# EAGLE design ignition3 (EAGLE 7.2.0)
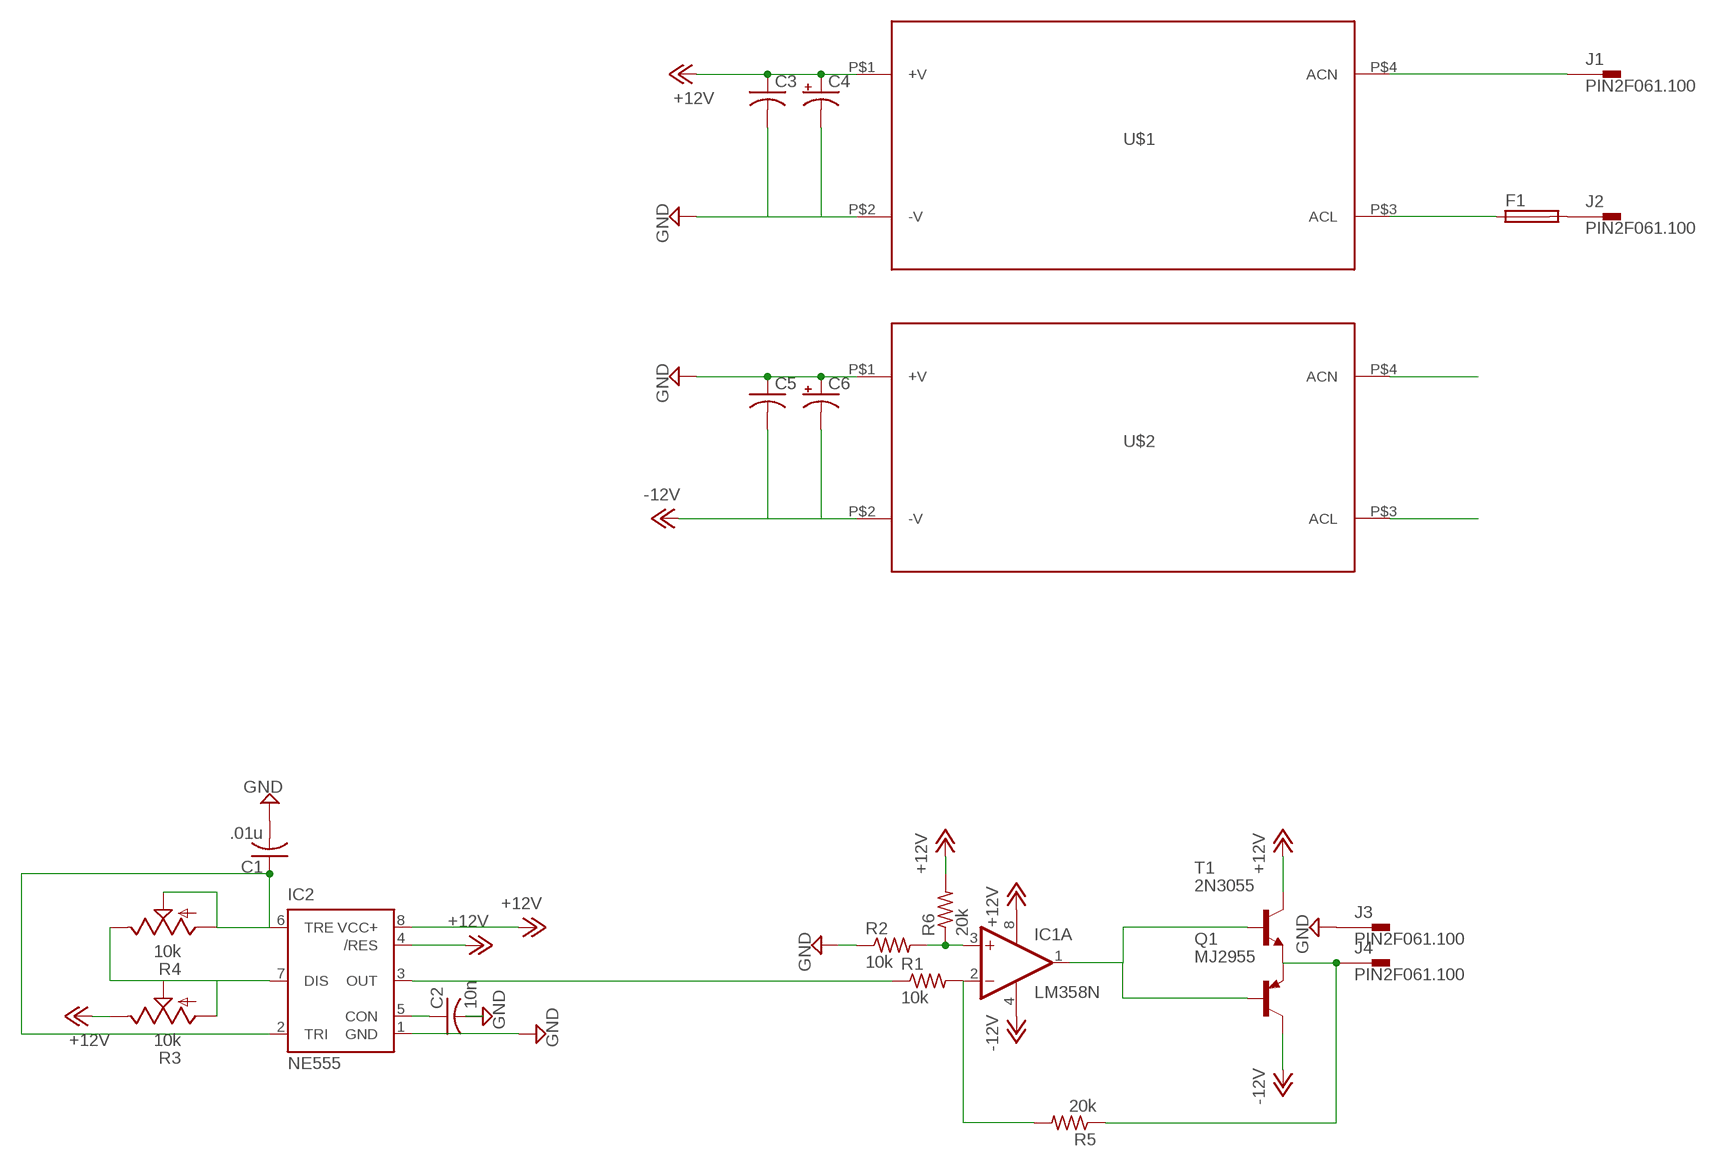
[diagram p0: schematic, sheet 1]

## Parts
C1  .01u  C-US050-035X075  [C050-035X075]
C2  10n  C-US075-042X103  [C075-042X103]
C3  C-US050-035X075  [C050-035X075]
C4  CPOL-USE5-5  [E5-5]
C5  C-US050-035X075  [C050-035X075]
C6  CPOL-USE5-5  [E5-5]
F1  SH25  [SH25]
IC1  LM358N  [DIL08]
IC2  NE555  [DIL-08]
J1  PIN2F061.100  [F061.100]
J2  PIN2F061.100  [F061.100]
J3  PIN2F061.100  [F061.100]
J4  PIN2F061.100  [F061.100]
Q1  MJ2955  [TO3]
R1  10k  R-US_0207/10  [0207/10]
R2  10k  R-US_0207/10  [0207/10]
R3  10k  TRIM_US-B64Y  [B64Y]
R4  10k  TRIM_US-B64Y  [B64Y]
R5  20k  R-US_0207/10  [0207/10]
R6  20k  R-US_0207/10  [0207/10]
T1  2N3055  [TO3]
U$1  IRM-60-12  [IRM-60-12]
U$2  IRM-60-12  [IRM-60-12]

## Nets
+12V: C3.1 C4.+ IC1.8(P:V+) IC2.4(/RES) IC2.8(VCC+) R3.E R6.2 T1.C T1.C/(C) U$1.P$1(+V)
-12V: C5.2 C6.- IC1.4(P:V-) Q1.C Q1.C/(C) U$2.P$2(-V)
GND: C1.2 C2.2 C3.2 C4.- C5.1 C6.+ IC2.1(GND) J3.A1 J3.A2 R2.1 U$1.P$2(-V) U$2.P$1(+V)
L: F1.1 U$1.P$3(ACL) U$2.P$3(ACL)
N: J1.A1 J1.A2 U$1.P$4(ACN) U$2.P$4(ACN)
N$1: IC1.2(A:-IN) R1.2 R5.2
N$2: C2.1 IC2.5(CON)
N$3: J4.A1 J4.A2 Q1.E R5.1 T1.E
N$5: F1.2 J2.A1 J2.A2
N$6: IC1.1(A:OUT) Q1.B T1.B
N$7: C1.1 IC2.2(TRI) IC2.6(TRE) R4.A R4.S
N$8: IC2.7(DIS) R3.A R3.S R4.E
N$9: IC1.3(A:+IN) R2.2 R6.1
N$12: IC2.3(OUT) R1.1
Unconnected: IC1.5(B:+IN) IC1.6(B:-IN) IC1.7(B:OUT)

## Library data of the parts
C1-C3 C5 = rcl:C-US: CAPACITOR, American symbol
C4 C6 = rcl:CPOL-US: POLARIZED CAPACITOR, American symbol
F1 = fuse:SH25: FUSE HOLDER grid 25 mm, OGN0031 8211, Schurter (Buerklin); MF: SCHURTER; MPN: 0031.8211; OC_FARNELL: 1162741; OC_NEWARK: 96B9380
IC1 = linear:LM358: OP AMP also LM158; LM258; LM2904 Source: http://cache.national.com/ds/LM/LM158.pdf
IC2 = st-microelectronics:NE555: General purpose bipolar Timer; MF: Arrow Electronics; MPN: NE555N; OC_FARNELL: 1467742; OC_NEWARK: 89K1486
J1-J4 = con-faston:PIN2: Flachstecker Typ Tyco/Electronics/AMP TAB, FASTON Printed Circuit Board Tabs Source: http://www.buerklin.com, http://catalog.tycoelectronics.com; OC_FARNELL: unknown; OC_NEWARK: unknown
Q1 = transistor-pnp:MJ2955: PNP Transistor
R1 R2 R5 R6 = resistor:R-US_: RESISTOR, American symbol
R3 R4 = pot:TRIM_US-: POTENTIOMETER
T1 = transistor:2N3055: NPN TRANSISTOR
U$1 U$2 = meanwell:IRM-60-12

## Board
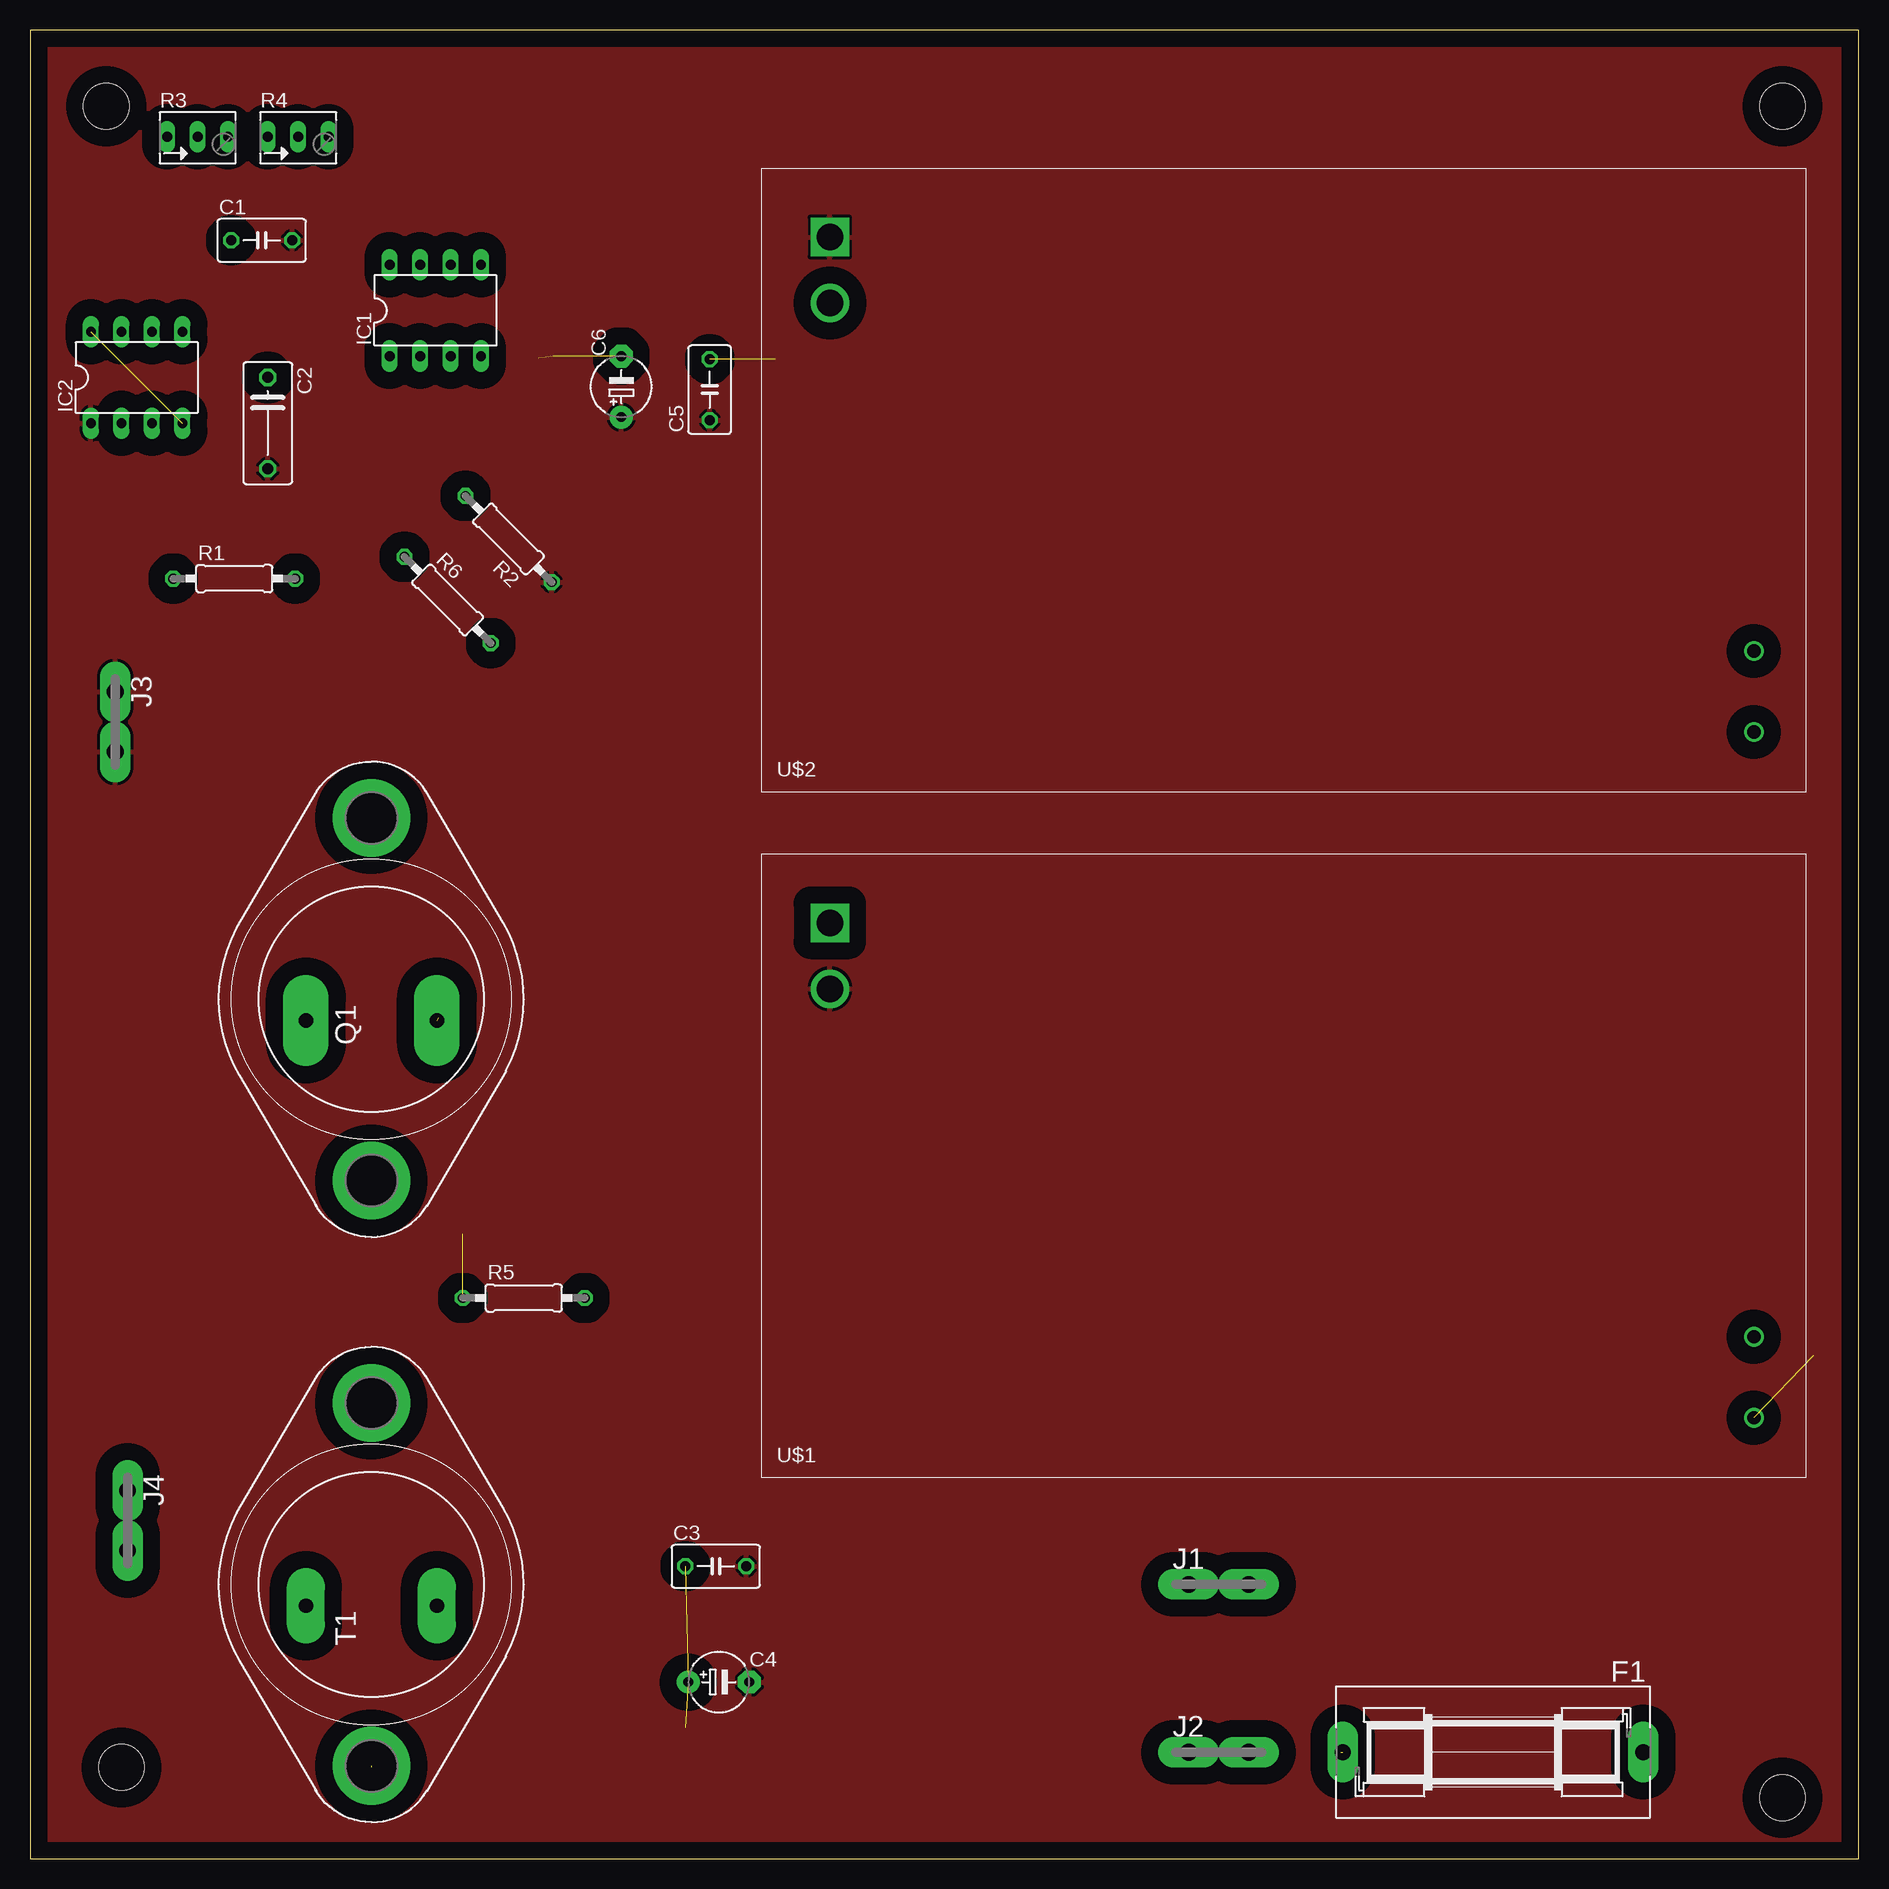
[diagram p1: board, top side]
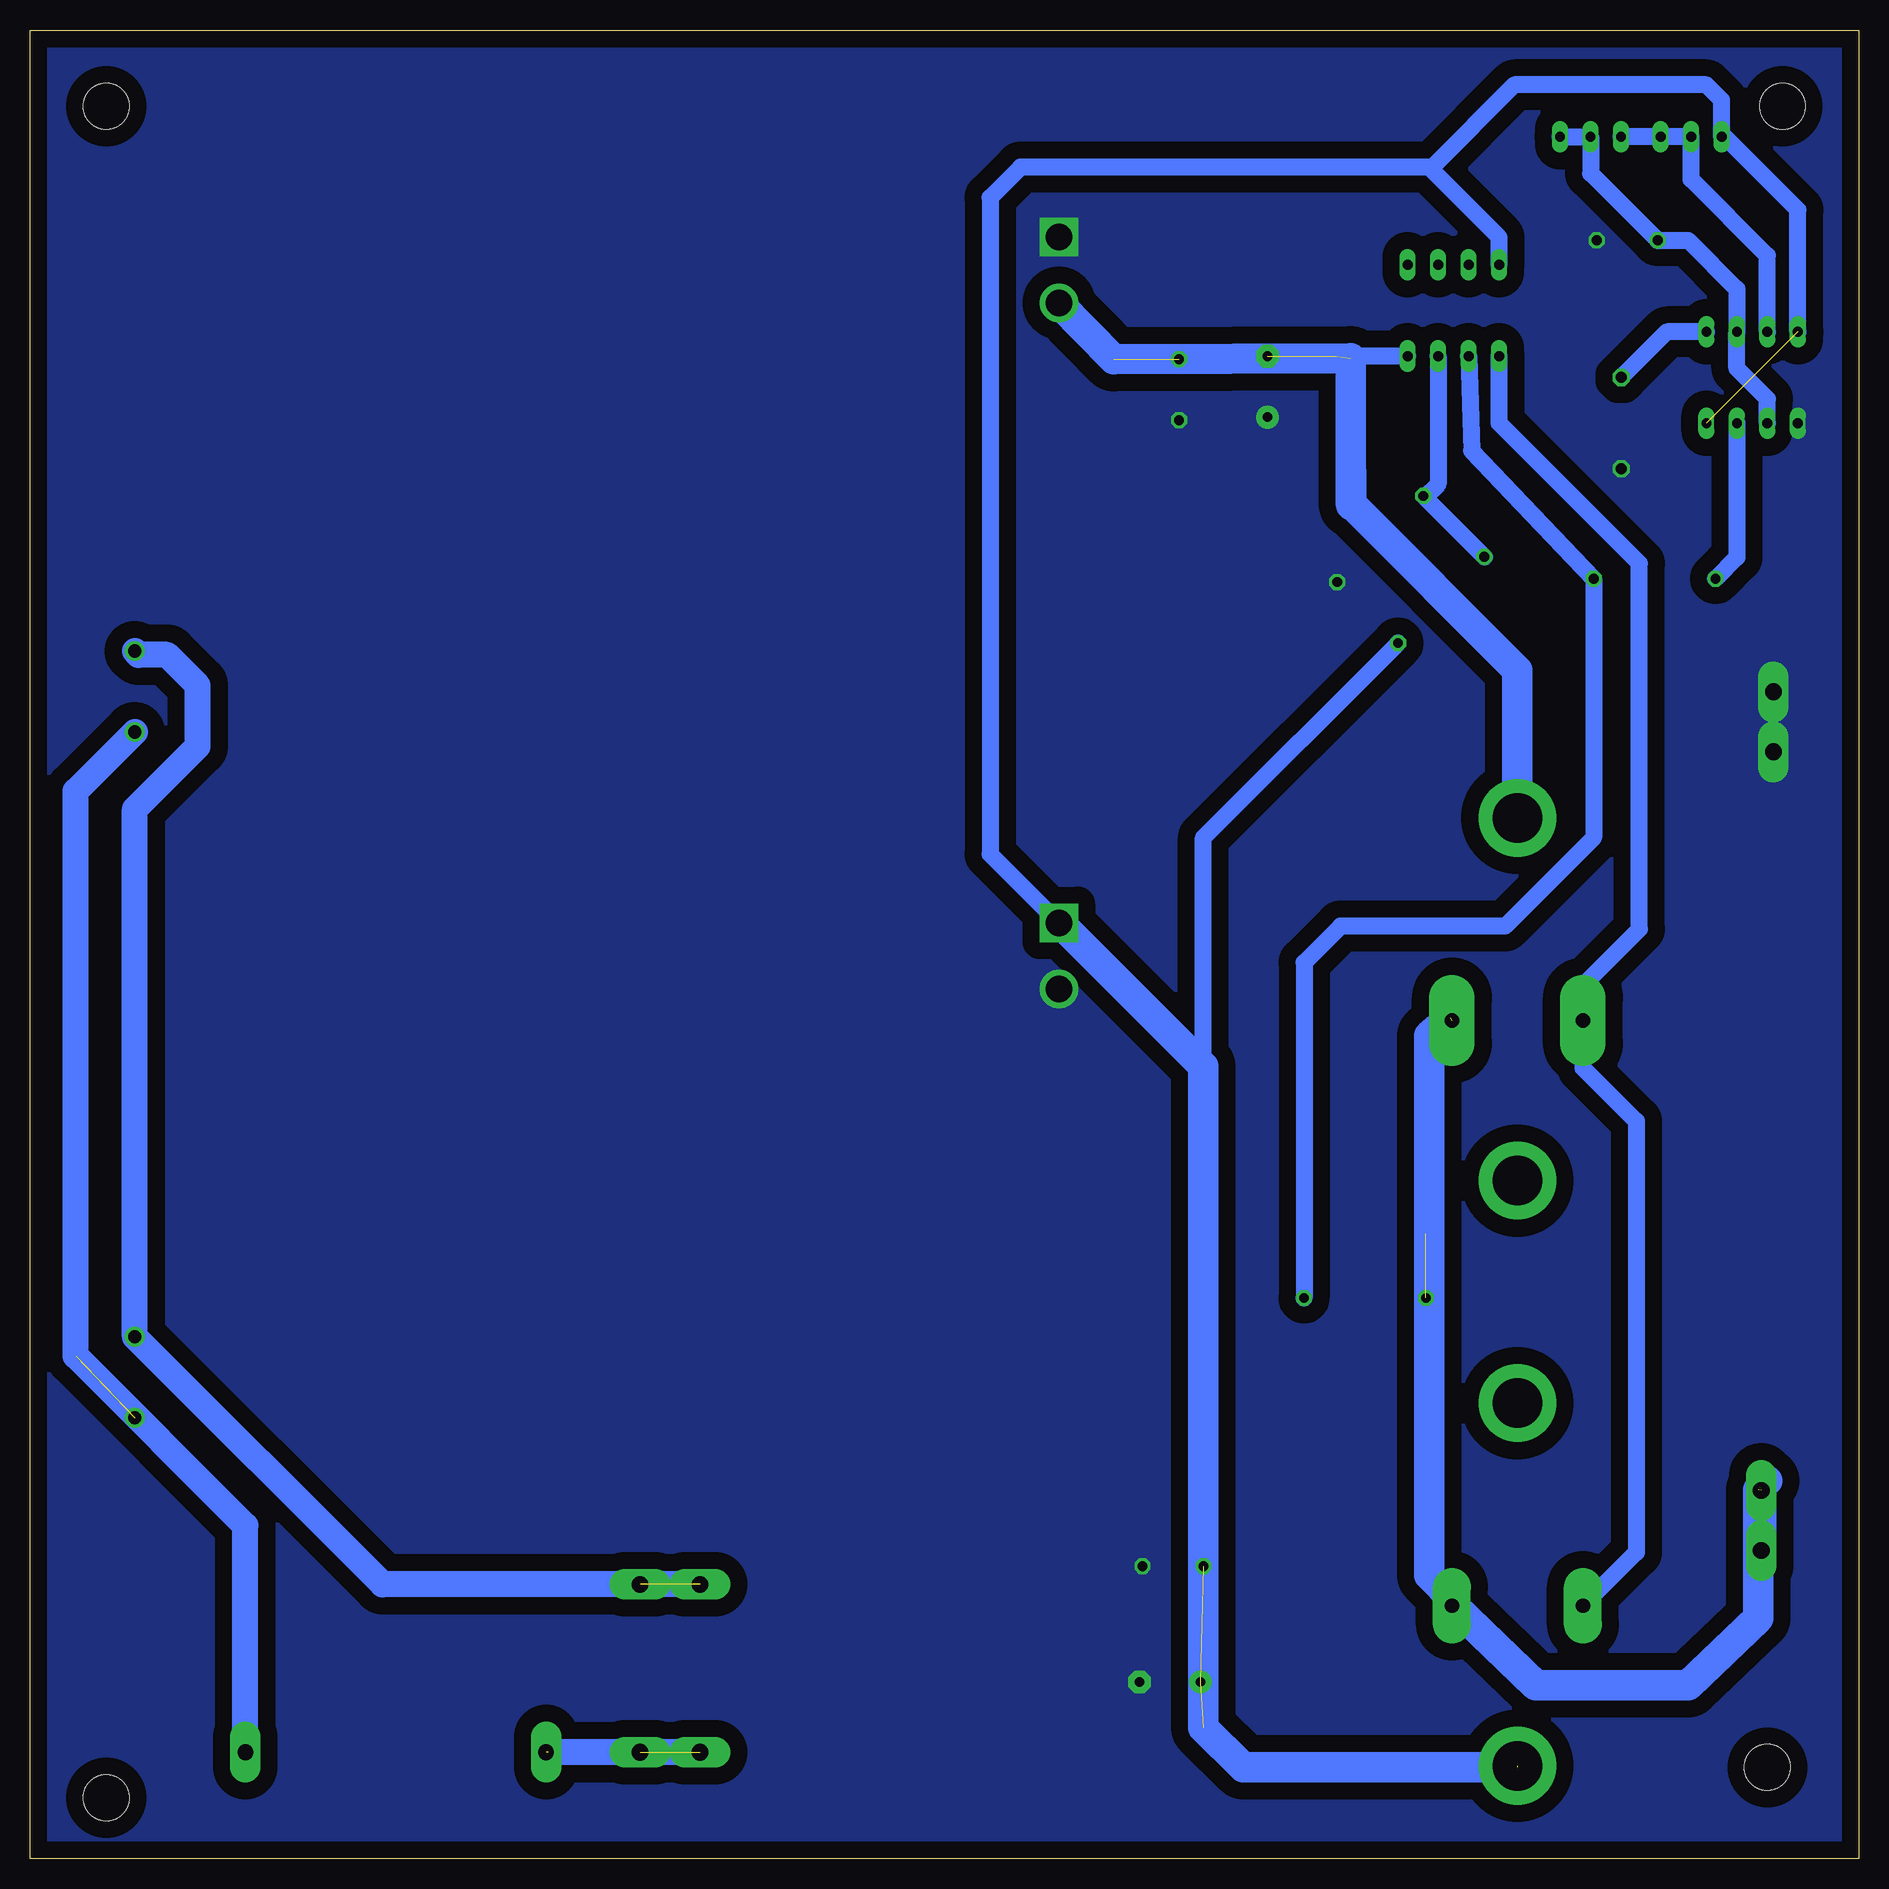
[diagram p2: board, bottom side, seen from below]

Size 152.4 x 152.4 mm. Coordinates in mm from the lower left corner, seen from the top.
Outline: 0,0 152.4,0 152.4,152.4 0,152.4 0,0
Copper layers (1*16): Top 0.035mm / dielectric 1.5mm / Bottom 0.035mm
Design rules "default": minimum track width 10mil, minimum drill 24mil, track to track 8mil, track to pad 8mil, pad to pad 8mil, via to via 8mil, smd to smd 8mil, copper to edge 40mil, drill to drill 8mil, minimum pad ring 10mil, minimum via ring 8mil, stop-mask expansion 4mil, vias tented up to drill 0mil, thermal gap 10mil
Holes 3.8 mm at 146.05,5.08 6.35,146.05 7.62,7.62 146.05,146.05

### Footprints (pad centres in the part's own frame; a part is rotated, then mirrored left to right if it is on the bottom)
C050-035X075 = drill 0.813 octagon: 1 -2.54,0; 2 2.54,0
C075-042X103 = drill 0.914 octagon: 1 -3.81,0; 2 3.81,0
E5-5 = drill 0.813 pad 1.905: + -2.54,0 | drill 0.813 pad 1.905 octagon: - 2.54,0
SH25 = drill 1.321 pad 2.54 long: 1 -12.522,0; 2 12.522,0
DIL08 = drill 0.813 long: 1 -3.81,-3.81; 2 -1.27,-3.81; 3 1.27,-3.81; 4 3.81,-3.81; 5 3.81,3.81; 6 1.27,3.81; 7 -1.27,3.81; 8 -3.81,3.81
DIL-08 = drill 0.813 long: 1 -3.81,-3.81; 2 -1.27,-3.81; 3 1.27,-3.81; 4 3.81,-3.81; 5 3.81,3.81; 6 1.27,3.81; 7 -1.27,3.81; 8 -3.81,3.81
F061.100 = drill 1.4 pad 2.54 long: A1 -2.5,0; A2 2.5,0
TO3 = drill 1.194 pad 3.81 long: B -1.778,5.461; E -1.778,-5.461 | drill 4.115 pad 6.477: C 15.113,0; C/ -15.113,0
0207/10 = drill 0.813 octagon: 1 -5.08,0; 2 5.08,0
B64Y = drill 0.813 long: A 2.54,0; E -2.54,0; S 0,0
TO3' = drill 1.194 pad 3.15 long: B -1.778,5.461; E -1.778,-5.461 | drill 4.115 pad 6.477: C 15.113,0; C/ -15.113,0
IRM-60-12 = drill 2.2 square: P$1 5.7,46.25 | drill 2.2: P$2 5.7,40.75 | drill 1.1: P$3 82.7,5; P$4 82.7,11.75

### Placement (x,y rotation side)
C1  19.3,134.87 0 top
C2  19.81,119.63 270 top
C3  57.15,24.38 0 top
C4  57.4,14.73 0 top
C5  56.64,122.43 90 top
C6  49.28,122.68 90 top
F1  121.92,8.89 180 top
IC1  33.78,129.03 0 top
IC2  8.89,123.44 0 top
J1  99.06,22.86 0 top
J2  99.06,8.89 0 top
J3  7.11,94.74 270 top
J4  8.13,28.19 270 top
Q1  28.45,71.63 90 top
R1  17.02,106.68 0 top
R2  39.88,109.98 135 top
R3  13.97,143.51 0 top
R4  22.35,143.51 0 top
R5  41.15,46.74 0 top
R6  34.8,104.9 315 top
T1  2N3055  [TO3']  28.45,22.86 90 top
U$1  60.96,31.75 0 top
U$2  60.96,88.9 0 top

### Tracks (layer width: path | path; a pad name or v marks a point on that pad's centre or on a via)
+12V  (4 unrouted)
  Bottom 1.422: 35.81,140.97 35.56,140.97 28.7,147.83 12.7,147.83 11.43,146.56 R3.E 11.18,143.51 5.08,137.41 IC2.8 | 35.81,140.97 69.85,140.97 72.39,138.43 72.39,83.73 U$1.P$1 | 28.32,38.1 T1.C | 54.61,66.04 54.61,85.09 R6.2 | IC1.8 29.97,135.13 35.81,140.97
  Bottom 2.184: U$1.P$1 66.57,78
  Bottom 2.54: 66.57,78 54.61,66.04 54.61,10.92 51.31,7.62 28.45,7.62
-12V  (3 unrouted)
  Bottom 1.422: IC1.4 43.59,125.22
  Bottom 2.54: U$2.P$2 62.09,124.95 42.35,125.03 | 42.35,125.03 42.32,118.88 42.29,112.78 | 42.35,125.03 42.35,112.97 28.45,99.06 Q1.C
GND
  pour Bottom (isolate 1.422, no thermals): 0,152.4 152.4,152.4 152.4,0 0,0
  pour Top (isolate 1.422): -0.25,152.65 152.4,152.65 152.4,0 -0.25,0
L  (1 unrouted)
  Bottom 2.184: U$2.P$3 148.59,88.97 148.59,41.91 134.44,27.76 F1.1
N  (1 unrouted)
  Bottom 2.184: J1.A1 123.02,22.86 U$1.P$4 143.66,87.48 138.43,92.71 138.43,97.79 140.97,100.33 143.34,100.33 U$2.P$4
N$1
  Bottom 1.422: IC1.2 32.26,117.35 R1.2 22.1,85.09 29.46,77.72 43.18,77.72 46.23,74.68 R5.2
N$2
  Bottom 1.422: IC2.5 16,127.25 C2.1
N$3  (3 unrouted)
  Bottom 1.422: T1.E 33.78,21.08 | 36.07,52.07 35.81,52.32
  Bottom 2.54: J4.A2 J4.A1 | 33.78,21.08 26.92,14.48 14.22,14.48 8.38,20.07 8.38,30.73 7.62,31.5 | T1.E 33.91,21.72 35.81,23.62 35.81,52.32 35.81,68.58 34.04,70.1
N$5  (2 unrouted)
  Bottom 2.184: J2.A1 109.22,8.89
N$6
  Bottom 1.422: IC1.1 29.97,119.63 18.29,107.95 18.29,77.47 22.99,72.77 Q1.B 22.99,65.91 18.54,61.47 18.54,25.53 T1.B
N$7
  Bottom 1.422: R4.A R4.S 22.35,140.46 C1.1 14.22,134.87 10.16,130.81 IC2.6 10.16,124.21 7.62,121.67 IC2.2
N$8
  Bottom 1.422: IC2.7 7.62,133.6 13.97,139.95 R3.S R3.A R4.E
N$9
  Bottom 1.422: R2.2 36.16,113.45 | 36.16,113.45 R6.1 | IC1.3 35.05,114.55 36.16,113.45
N$12
  Bottom 1.422: IC2.3 10.16,108.46 R1.1